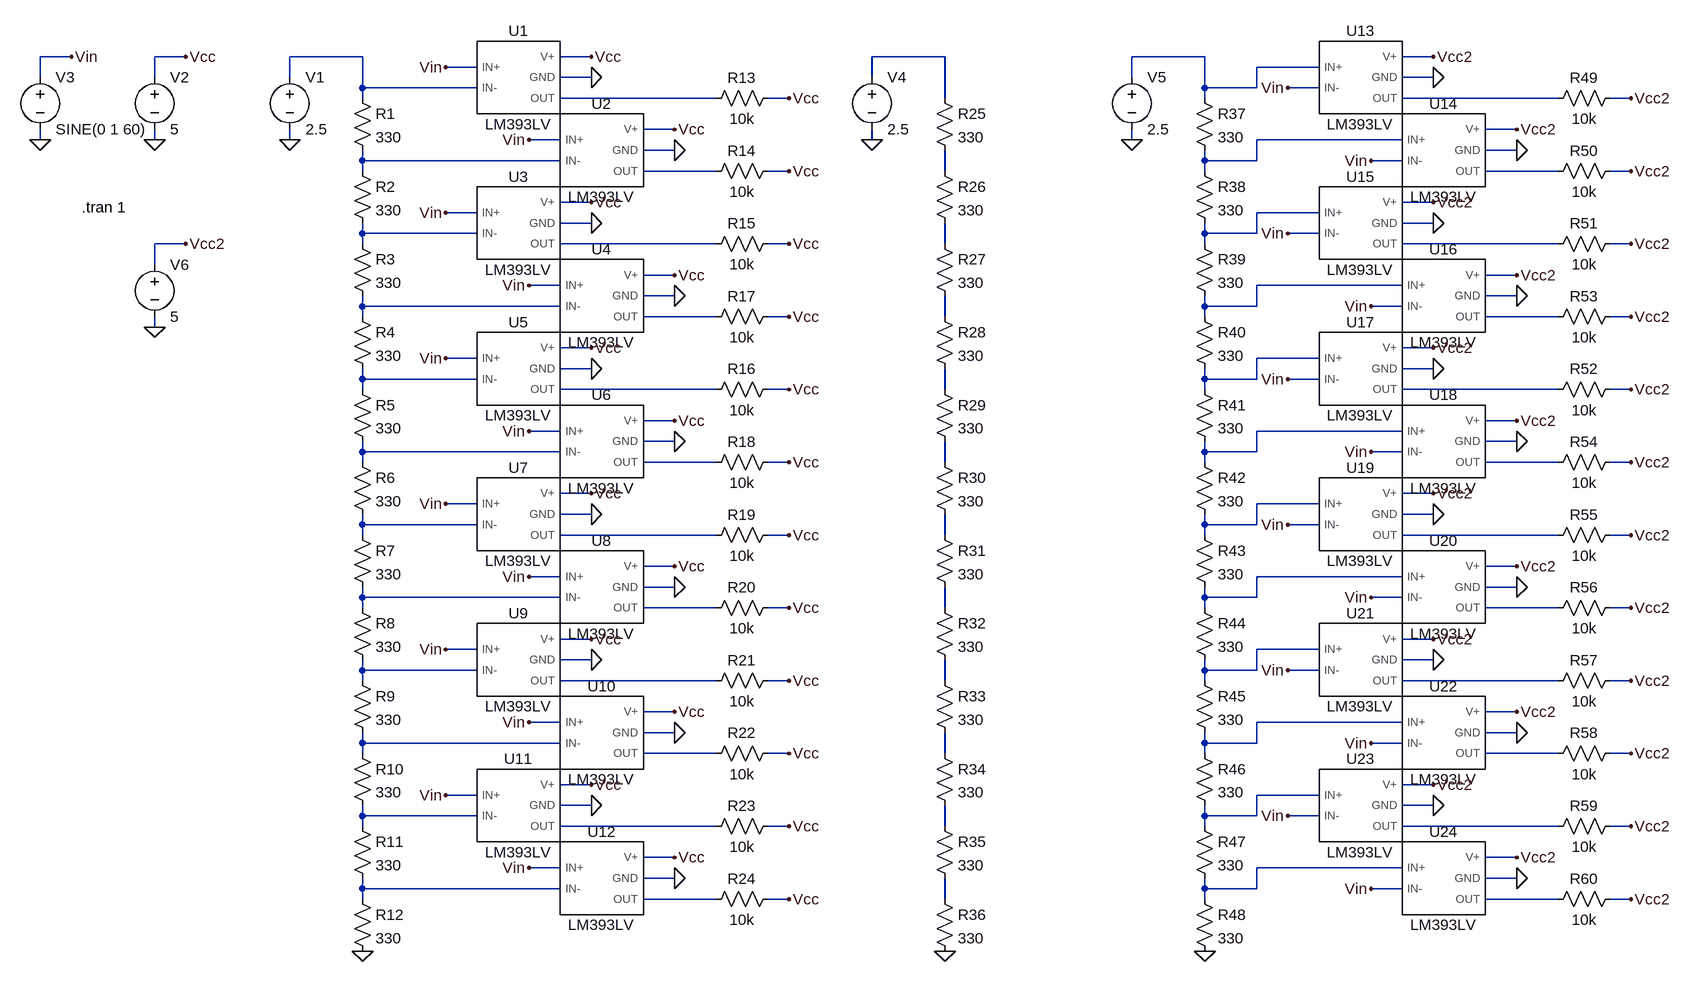
[diagram p0: schematic Voltage Reference Test.asc]
Voltage Reference Test.asc, the LTspice schematic file:
Version 4
SHEET 1 2236 1428
WIRE -272 32 -320 32
WIRE -96 32 -144 32
WIRE 176 32 64 32
WIRE 528 32 480 32
WIRE 1072 32 960 32
WIRE 1472 32 1360 32
WIRE 1824 32 1776 32
WIRE 352 48 304 48
WIRE 1648 48 1552 48
WIRE -320 64 -320 32
WIRE -144 64 -144 32
WIRE 64 64 64 32
WIRE 528 64 480 64
WIRE 960 64 960 32
WIRE 1360 64 1360 32
WIRE 1824 64 1776 64
WIRE 176 80 176 32
WIRE 352 80 176 80
WIRE 1472 80 1472 32
WIRE 1552 80 1552 48
WIRE 1552 80 1472 80
WIRE 1648 80 1600 80
WIRE 176 96 176 80
WIRE 720 96 480 96
WIRE 832 96 800 96
WIRE 1072 96 1072 32
WIRE 1472 96 1472 80
WIRE 2016 96 1776 96
WIRE 2128 96 2096 96
WIRE 656 144 608 144
WIRE 1952 144 1904 144
WIRE -320 160 -320 144
WIRE -144 160 -144 144
WIRE 64 160 64 144
WIRE 480 160 432 160
WIRE 960 160 960 144
WIRE 1360 160 1360 144
WIRE 1776 160 1552 160
WIRE 656 176 608 176
WIRE 1952 176 1904 176
WIRE 176 192 176 176
WIRE 480 192 176 192
WIRE 1472 192 1472 176
WIRE 1552 192 1552 160
WIRE 1552 192 1472 192
WIRE 1776 192 1728 192
WIRE 176 208 176 192
WIRE 720 208 608 208
WIRE 832 208 800 208
WIRE 1072 208 1072 176
WIRE 1472 208 1472 192
WIRE 2016 208 1904 208
WIRE 2128 208 2096 208
WIRE 528 256 480 256
WIRE 1824 256 1776 256
WIRE 352 272 304 272
WIRE 1648 272 1552 272
WIRE 528 288 480 288
WIRE 1824 288 1776 288
WIRE 176 304 176 288
WIRE 352 304 176 304
WIRE 1472 304 1472 288
WIRE 1552 304 1552 272
WIRE 1552 304 1472 304
WIRE 1648 304 1600 304
WIRE -96 320 -144 320
WIRE 176 320 176 304
WIRE 720 320 480 320
WIRE 832 320 800 320
WIRE 1072 320 1072 288
WIRE 1472 320 1472 304
WIRE 2016 320 1776 320
WIRE 2128 320 2096 320
WIRE -144 352 -144 320
WIRE 656 368 608 368
WIRE 1952 368 1904 368
WIRE 480 384 432 384
WIRE 1776 384 1552 384
WIRE 656 400 608 400
WIRE 1952 400 1904 400
WIRE 176 416 176 400
WIRE 480 416 176 416
WIRE 1472 416 1472 400
WIRE 1552 416 1552 384
WIRE 1552 416 1472 416
WIRE 1776 416 1728 416
WIRE 176 432 176 416
WIRE 720 432 608 432
WIRE 832 432 800 432
WIRE 1072 432 1072 400
WIRE 1472 432 1472 416
WIRE 2016 432 1904 432
WIRE 2128 432 2096 432
WIRE -144 448 -144 432
WIRE 528 480 480 480
WIRE 1824 480 1776 480
WIRE 352 496 304 496
WIRE 1648 496 1552 496
WIRE 528 512 480 512
WIRE 1824 512 1776 512
WIRE 176 528 176 512
WIRE 352 528 176 528
WIRE 1472 528 1472 512
WIRE 1552 528 1552 496
WIRE 1552 528 1472 528
WIRE 1648 528 1600 528
WIRE 176 544 176 528
WIRE 720 544 480 544
WIRE 832 544 800 544
WIRE 1072 544 1072 512
WIRE 1472 544 1472 528
WIRE 2016 544 1776 544
WIRE 2128 544 2096 544
WIRE 656 592 608 592
WIRE 1952 592 1904 592
WIRE 480 608 432 608
WIRE 1776 608 1552 608
WIRE 656 624 608 624
WIRE 1952 624 1904 624
WIRE 176 640 176 624
WIRE 480 640 176 640
WIRE 1472 640 1472 624
WIRE 1552 640 1552 608
WIRE 1552 640 1472 640
WIRE 1776 640 1728 640
WIRE 176 656 176 640
WIRE 720 656 608 656
WIRE 832 656 800 656
WIRE 1072 656 1072 624
WIRE 1472 656 1472 640
WIRE 2016 656 1904 656
WIRE 2128 656 2096 656
WIRE 528 704 480 704
WIRE 1824 704 1776 704
WIRE 352 720 304 720
WIRE 1648 720 1552 720
WIRE 528 736 480 736
WIRE 1824 736 1776 736
WIRE 176 752 176 736
WIRE 352 752 176 752
WIRE 1472 752 1472 736
WIRE 1552 752 1552 720
WIRE 1552 752 1472 752
WIRE 1648 752 1600 752
WIRE 176 768 176 752
WIRE 720 768 480 768
WIRE 832 768 800 768
WIRE 1072 768 1072 736
WIRE 1472 768 1472 752
WIRE 2016 768 1776 768
WIRE 2128 768 2096 768
WIRE 656 816 608 816
WIRE 1952 816 1904 816
WIRE 480 832 432 832
WIRE 1776 832 1552 832
WIRE 656 848 608 848
WIRE 1952 848 1904 848
WIRE 176 864 176 848
WIRE 480 864 176 864
WIRE 1472 864 1472 848
WIRE 1552 864 1552 832
WIRE 1552 864 1472 864
WIRE 1776 864 1728 864
WIRE 176 880 176 864
WIRE 720 880 608 880
WIRE 832 880 800 880
WIRE 1072 880 1072 848
WIRE 1472 880 1472 864
WIRE 2016 880 1904 880
WIRE 2128 880 2096 880
WIRE 528 928 480 928
WIRE 1824 928 1776 928
WIRE 352 944 304 944
WIRE 1648 944 1552 944
WIRE 528 960 480 960
WIRE 1824 960 1776 960
WIRE 176 976 176 960
WIRE 352 976 176 976
WIRE 1472 976 1472 960
WIRE 1552 976 1552 944
WIRE 1552 976 1472 976
WIRE 1648 976 1600 976
WIRE 176 992 176 976
WIRE 720 992 480 992
WIRE 832 992 800 992
WIRE 1072 992 1072 960
WIRE 1472 992 1472 976
WIRE 2016 992 1776 992
WIRE 2128 992 2096 992
WIRE 656 1040 608 1040
WIRE 1952 1040 1904 1040
WIRE 480 1056 432 1056
WIRE 1776 1056 1552 1056
WIRE 656 1072 608 1072
WIRE 1952 1072 1904 1072
WIRE 176 1088 176 1072
WIRE 480 1088 176 1088
WIRE 1472 1088 1472 1072
WIRE 1552 1088 1552 1056
WIRE 1552 1088 1472 1088
WIRE 1776 1088 1728 1088
WIRE 176 1104 176 1088
WIRE 720 1104 608 1104
WIRE 832 1104 800 1104
WIRE 1072 1104 1072 1072
WIRE 1472 1104 1472 1088
WIRE 2016 1104 1904 1104
WIRE 2128 1104 2096 1104
WIRE 528 1152 480 1152
WIRE 1824 1152 1776 1152
WIRE 352 1168 304 1168
WIRE 1648 1168 1552 1168
WIRE 528 1184 480 1184
WIRE 1824 1184 1776 1184
WIRE 176 1200 176 1184
WIRE 352 1200 176 1200
WIRE 1472 1200 1472 1184
WIRE 1552 1200 1552 1168
WIRE 1552 1200 1472 1200
WIRE 1648 1200 1600 1200
WIRE 176 1216 176 1200
WIRE 720 1216 480 1216
WIRE 832 1216 800 1216
WIRE 1072 1216 1072 1184
WIRE 1472 1216 1472 1200
WIRE 2016 1216 1776 1216
WIRE 2128 1216 2096 1216
WIRE 656 1264 608 1264
WIRE 1952 1264 1904 1264
WIRE 480 1280 432 1280
WIRE 1776 1280 1552 1280
WIRE 656 1296 608 1296
WIRE 1952 1296 1904 1296
WIRE 176 1312 176 1296
WIRE 480 1312 176 1312
WIRE 1472 1312 1472 1296
WIRE 1552 1312 1552 1280
WIRE 1552 1312 1472 1312
WIRE 1776 1312 1728 1312
WIRE 176 1328 176 1312
WIRE 720 1328 608 1328
WIRE 832 1328 800 1328
WIRE 1072 1328 1072 1296
WIRE 1472 1328 1472 1312
WIRE 2016 1328 1904 1328
WIRE 2128 1328 2096 1328
FLAG 176 1408 0
FLAG 64 160 0
FLAG -96 32 Vcc
FLAG -144 160 0
FLAG 304 48 Vin
FLAG 432 160 Vin
FLAG 304 272 Vin
FLAG 432 384 Vin
FLAG 432 608 Vin
FLAG 432 832 Vin
FLAG 304 496 Vin
FLAG 304 720 Vin
FLAG 304 944 Vin
FLAG 304 1168 Vin
FLAG 432 1056 Vin
FLAG 432 1280 Vin
FLAG -320 160 0
FLAG -272 32 Vin
FLAG 528 32 Vcc
FLAG 528 64 0
FLAG 528 256 Vcc
FLAG 528 288 0
FLAG 656 144 Vcc
FLAG 656 176 0
FLAG 656 368 Vcc
FLAG 656 400 0
FLAG 528 480 Vcc
FLAG 528 512 0
FLAG 528 704 Vcc
FLAG 528 736 0
FLAG 528 928 Vcc
FLAG 528 960 0
FLAG 528 1152 Vcc
FLAG 528 1184 0
FLAG 656 592 Vcc
FLAG 656 624 0
FLAG 656 816 Vcc
FLAG 656 848 0
FLAG 656 1040 Vcc
FLAG 656 1072 0
FLAG 656 1264 Vcc
FLAG 656 1296 0
FLAG 832 96 Vcc
FLAG 832 208 Vcc
FLAG 832 320 Vcc
FLAG 832 544 Vcc
FLAG 832 432 Vcc
FLAG 832 656 Vcc
FLAG 832 768 Vcc
FLAG 832 880 Vcc
FLAG 832 992 Vcc
FLAG 832 1104 Vcc
FLAG 832 1216 Vcc
FLAG 832 1328 Vcc
FLAG 1072 1408 0
FLAG 960 160 0
FLAG 1472 1408 0
FLAG 1360 160 0
FLAG 1600 80 Vin
FLAG 1728 192 Vin
FLAG 1600 304 Vin
FLAG 1728 416 Vin
FLAG 1728 640 Vin
FLAG 1728 864 Vin
FLAG 1600 528 Vin
FLAG 1600 752 Vin
FLAG 1600 976 Vin
FLAG 1600 1200 Vin
FLAG 1728 1088 Vin
FLAG 1728 1312 Vin
FLAG 1824 64 0
FLAG 1824 288 0
FLAG 1952 176 0
FLAG 1952 400 0
FLAG 1824 512 0
FLAG 1824 736 0
FLAG 1824 960 0
FLAG 1824 1184 0
FLAG 1952 624 0
FLAG 1952 848 0
FLAG 1952 1072 0
FLAG 1952 1296 0
FLAG -96 320 Vcc2
FLAG -144 448 0
FLAG 2128 96 Vcc2
FLAG 2128 320 Vcc2
FLAG 2128 208 Vcc2
FLAG 2128 432 Vcc2
FLAG 2128 544 Vcc2
FLAG 2128 656 Vcc2
FLAG 2128 768 Vcc2
FLAG 2128 880 Vcc2
FLAG 2128 992 Vcc2
FLAG 2128 1104 Vcc2
FLAG 2128 1216 Vcc2
FLAG 2128 1328 Vcc2
FLAG 1824 32 Vcc2
FLAG 1824 256 Vcc2
FLAG 1952 144 Vcc2
FLAG 1952 368 Vcc2
FLAG 1952 592 Vcc2
FLAG 1824 480 Vcc2
FLAG 1824 704 Vcc2
FLAG 1952 816 Vcc2
FLAG 1824 928 Vcc2
FLAG 1952 1040 Vcc2
FLAG 1824 1152 Vcc2
FLAG 1952 1264 Vcc2
SYMBOL res 160 80 R0
SYMATTR InstName R1
SYMATTR Value 330
SYMBOL res 160 192 R0
SYMATTR InstName R2
SYMATTR Value 330
SYMBOL res 160 304 R0
SYMATTR InstName R3
SYMATTR Value 330
SYMBOL res 160 416 R0
SYMATTR InstName R4
SYMATTR Value 330
SYMBOL res 160 528 R0
SYMATTR InstName R5
SYMATTR Value 330
SYMBOL res 160 640 R0
SYMATTR InstName R6
SYMATTR Value 330
SYMBOL res 160 752 R0
SYMATTR InstName R7
SYMATTR Value 330
SYMBOL res 160 864 R0
SYMATTR InstName R8
SYMATTR Value 330
SYMBOL res 160 976 R0
SYMATTR InstName R9
SYMATTR Value 330
SYMBOL res 160 1088 R0
SYMATTR InstName R10
SYMATTR Value 330
SYMBOL res 160 1200 R0
SYMATTR InstName R11
SYMATTR Value 330
SYMBOL res 160 1312 R0
SYMATTR InstName R12
SYMATTR Value 330
SYMBOL voltage 64 48 R0
SYMATTR InstName V1
SYMATTR Value 2.5
SYMBOL LM393LV 416 64 R0
SYMATTR InstName U1
SYMBOL LM393LV 544 176 R0
SYMATTR InstName U2
SYMBOL LM393LV 416 288 R0
SYMATTR InstName U3
SYMBOL LM393LV 544 400 R0
SYMATTR InstName U4
SYMBOL LM393LV 416 512 R0
SYMATTR InstName U5
SYMBOL LM393LV 544 624 R0
SYMATTR InstName U6
SYMBOL LM393LV 416 736 R0
SYMATTR InstName U7
SYMBOL LM393LV 544 848 R0
SYMATTR InstName U8
SYMBOL LM393LV 416 960 R0
SYMATTR InstName U9
SYMBOL LM393LV 544 1072 R0
SYMATTR InstName U10
SYMBOL LM393LV 416 1184 R0
SYMATTR InstName U11
SYMBOL LM393LV 544 1296 R0
SYMATTR InstName U12
SYMBOL voltage -144 48 R0
SYMATTR InstName V2
SYMATTR Value 5
SYMBOL voltage -320 48 R0
WINDOW 123 0 0 Left 0
WINDOW 39 0 0 Left 0
SYMATTR InstName V3
SYMATTR Value SINE(0 1 60)
SYMBOL res 816 80 R90
WINDOW 0 0 56 VBottom 2
WINDOW 3 32 56 VTop 2
SYMATTR InstName R13
SYMATTR Value 10k
SYMBOL res 816 192 R90
WINDOW 0 0 56 VBottom 2
WINDOW 3 32 56 VTop 2
SYMATTR InstName R14
SYMATTR Value 10k
SYMBOL res 816 304 R90
WINDOW 0 0 56 VBottom 2
WINDOW 3 32 56 VTop 2
SYMATTR InstName R15
SYMATTR Value 10k
SYMBOL res 816 528 R90
WINDOW 0 0 56 VBottom 2
WINDOW 3 32 56 VTop 2
SYMATTR InstName R16
SYMATTR Value 10k
SYMBOL res 816 416 R90
WINDOW 0 0 56 VBottom 2
WINDOW 3 32 56 VTop 2
SYMATTR InstName R17
SYMATTR Value 10k
SYMBOL res 816 640 R90
WINDOW 0 0 56 VBottom 2
WINDOW 3 32 56 VTop 2
SYMATTR InstName R18
SYMATTR Value 10k
SYMBOL res 816 752 R90
WINDOW 0 0 56 VBottom 2
WINDOW 3 32 56 VTop 2
SYMATTR InstName R19
SYMATTR Value 10k
SYMBOL res 816 864 R90
WINDOW 0 0 56 VBottom 2
WINDOW 3 32 56 VTop 2
SYMATTR InstName R20
SYMATTR Value 10k
SYMBOL res 816 976 R90
WINDOW 0 0 56 VBottom 2
WINDOW 3 32 56 VTop 2
SYMATTR InstName R21
SYMATTR Value 10k
SYMBOL res 816 1088 R90
WINDOW 0 0 56 VBottom 2
WINDOW 3 32 56 VTop 2
SYMATTR InstName R22
SYMATTR Value 10k
SYMBOL res 816 1200 R90
WINDOW 0 0 56 VBottom 2
WINDOW 3 32 56 VTop 2
SYMATTR InstName R23
SYMATTR Value 10k
SYMBOL res 816 1312 R90
WINDOW 0 0 56 VBottom 2
WINDOW 3 32 56 VTop 2
SYMATTR InstName R24
SYMATTR Value 10k
SYMBOL res 1056 80 R0
SYMATTR InstName R25
SYMATTR Value 330
SYMBOL res 1056 192 R0
SYMATTR InstName R26
SYMATTR Value 330
SYMBOL res 1056 304 R0
SYMATTR InstName R27
SYMATTR Value 330
SYMBOL res 1056 416 R0
SYMATTR InstName R28
SYMATTR Value 330
SYMBOL res 1056 528 R0
SYMATTR InstName R29
SYMATTR Value 330
SYMBOL res 1056 640 R0
SYMATTR InstName R30
SYMATTR Value 330
SYMBOL res 1056 752 R0
SYMATTR InstName R31
SYMATTR Value 330
SYMBOL res 1056 864 R0
SYMATTR InstName R32
SYMATTR Value 330
SYMBOL res 1056 976 R0
SYMATTR InstName R33
SYMATTR Value 330
SYMBOL res 1056 1088 R0
SYMATTR InstName R34
SYMATTR Value 330
SYMBOL res 1056 1200 R0
SYMATTR InstName R35
SYMATTR Value 330
SYMBOL res 1056 1312 R0
SYMATTR InstName R36
SYMATTR Value 330
SYMBOL voltage 960 48 R0
SYMATTR InstName V4
SYMATTR Value 2.5
SYMBOL res 1456 80 R0
SYMATTR InstName R37
SYMATTR Value 330
SYMBOL res 1456 192 R0
SYMATTR InstName R38
SYMATTR Value 330
SYMBOL res 1456 304 R0
SYMATTR InstName R39
SYMATTR Value 330
SYMBOL res 1456 416 R0
SYMATTR InstName R40
SYMATTR Value 330
SYMBOL res 1456 528 R0
SYMATTR InstName R41
SYMATTR Value 330
SYMBOL res 1456 640 R0
SYMATTR InstName R42
SYMATTR Value 330
SYMBOL res 1456 752 R0
SYMATTR InstName R43
SYMATTR Value 330
SYMBOL res 1456 864 R0
SYMATTR InstName R44
SYMATTR Value 330
SYMBOL res 1456 976 R0
SYMATTR InstName R45
SYMATTR Value 330
SYMBOL res 1456 1088 R0
SYMATTR InstName R46
SYMATTR Value 330
SYMBOL res 1456 1200 R0
SYMATTR InstName R47
SYMATTR Value 330
SYMBOL res 1456 1312 R0
SYMATTR InstName R48
SYMATTR Value 330
SYMBOL voltage 1360 48 R0
SYMATTR InstName V5
SYMATTR Value 2.5
SYMBOL LM393LV 1712 64 R0
SYMATTR InstName U13
SYMBOL LM393LV 1840 176 R0
SYMATTR InstName U14
SYMBOL LM393LV 1712 288 R0
SYMATTR InstName U15
SYMBOL LM393LV 1840 400 R0
SYMATTR InstName U16
SYMBOL LM393LV 1712 512 R0
SYMATTR InstName U17
SYMBOL LM393LV 1840 624 R0
SYMATTR InstName U18
SYMBOL LM393LV 1712 736 R0
SYMATTR InstName U19
SYMBOL LM393LV 1840 848 R0
SYMATTR InstName U20
SYMBOL LM393LV 1712 960 R0
SYMATTR InstName U21
SYMBOL LM393LV 1840 1072 R0
SYMATTR InstName U22
SYMBOL LM393LV 1712 1184 R0
SYMATTR InstName U23
SYMBOL LM393LV 1840 1296 R0
SYMATTR InstName U24
SYMBOL res 2112 80 R90
WINDOW 0 0 56 VBottom 2
WINDOW 3 32 56 VTop 2
SYMATTR InstName R49
SYMATTR Value 10k
SYMBOL res 2112 192 R90
WINDOW 0 0 56 VBottom 2
WINDOW 3 32 56 VTop 2
SYMATTR InstName R50
SYMATTR Value 10k
SYMBOL res 2112 304 R90
WINDOW 0 0 56 VBottom 2
WINDOW 3 32 56 VTop 2
SYMATTR InstName R51
SYMATTR Value 10k
SYMBOL res 2112 528 R90
WINDOW 0 0 56 VBottom 2
WINDOW 3 32 56 VTop 2
SYMATTR InstName R52
SYMATTR Value 10k
SYMBOL res 2112 416 R90
WINDOW 0 0 56 VBottom 2
WINDOW 3 32 56 VTop 2
SYMATTR InstName R53
SYMATTR Value 10k
SYMBOL res 2112 640 R90
WINDOW 0 0 56 VBottom 2
WINDOW 3 32 56 VTop 2
SYMATTR InstName R54
SYMATTR Value 10k
SYMBOL res 2112 752 R90
WINDOW 0 0 56 VBottom 2
WINDOW 3 32 56 VTop 2
SYMATTR InstName R55
SYMATTR Value 10k
SYMBOL res 2112 864 R90
WINDOW 0 0 56 VBottom 2
WINDOW 3 32 56 VTop 2
SYMATTR InstName R56
SYMATTR Value 10k
SYMBOL res 2112 976 R90
WINDOW 0 0 56 VBottom 2
WINDOW 3 32 56 VTop 2
SYMATTR InstName R57
SYMATTR Value 10k
SYMBOL res 2112 1088 R90
WINDOW 0 0 56 VBottom 2
WINDOW 3 32 56 VTop 2
SYMATTR InstName R58
SYMATTR Value 10k
SYMBOL res 2112 1200 R90
WINDOW 0 0 56 VBottom 2
WINDOW 3 32 56 VTop 2
SYMATTR InstName R59
SYMATTR Value 10k
SYMBOL res 2112 1312 R90
WINDOW 0 0 56 VBottom 2
WINDOW 3 32 56 VTop 2
SYMATTR InstName R60
SYMATTR Value 10k
SYMBOL voltage -144 336 R0
SYMATTR InstName V6
SYMATTR Value 5
TEXT -256 264 Left 2 !.tran 1

The netlist it stands for:
* Voltage Reference Test.asc
R1 N001 N007 330
R2 N007 N012 330
R3 N012 N017 330
R4 N017 N022 330
R5 N022 N027 330
R6 N027 N032 330
R7 N032 N037 330
R8 N037 N042 330
R9 N042 N047 330
R10 N047 N052 330
R11 N052 N057 330
R12 N057 0 330
V1 N001 0 2.5
XU1 Vin N001 Vcc 0 N004 LM393LV  ; pins IN+ IN- V+ GND OUT
XU2 Vin N007 Vcc 0 N008 LM393LV  ; pins IN+ IN- V+ GND OUT
XU3 Vin N012 Vcc 0 N013 LM393LV  ; pins IN+ IN- V+ GND OUT
XU4 Vin N017 Vcc 0 N018 LM393LV  ; pins IN+ IN- V+ GND OUT
XU5 Vin N022 Vcc 0 N023 LM393LV  ; pins IN+ IN- V+ GND OUT
XU6 Vin N027 Vcc 0 N028 LM393LV  ; pins IN+ IN- V+ GND OUT
XU7 Vin N032 Vcc 0 N033 LM393LV  ; pins IN+ IN- V+ GND OUT
XU8 Vin N037 Vcc 0 N038 LM393LV  ; pins IN+ IN- V+ GND OUT
XU9 Vin N042 Vcc 0 N043 LM393LV  ; pins IN+ IN- V+ GND OUT
XU10 Vin N047 Vcc 0 N048 LM393LV  ; pins IN+ IN- V+ GND OUT
XU11 Vin N052 Vcc 0 N053 LM393LV  ; pins IN+ IN- V+ GND OUT
XU12 Vin N057 Vcc 0 N058 LM393LV  ; pins IN+ IN- V+ GND OUT
V2 Vcc 0 5
V3 Vin 0 SINE(0 1 60)
R13 Vcc N004 10k
R14 Vcc N008 10k
R15 Vcc N013 10k
R16 Vcc N023 10k
R17 Vcc N018 10k
R18 Vcc N028 10k
R19 Vcc N033 10k
R20 Vcc N038 10k
R21 Vcc N043 10k
R22 Vcc N048 10k
R23 Vcc N053 10k
R24 Vcc N058 10k
R25 N002 N009 330
R26 N009 N014 330
R27 N014 N019 330
R28 N019 N024 330
R29 N024 N029 330
R30 N029 N034 330
R31 N034 N039 330
R32 N039 N044 330
R33 N044 N049 330
R34 N049 N054 330
R35 N054 N059 330
R36 N059 0 330
V4 N002 0 2.5
R37 N003 N006 330
R38 N006 N011 330
R39 N011 N016 330
R40 N016 N021 330
R41 N021 N026 330
R42 N026 N031 330
R43 N031 N036 330
R44 N036 N041 330
R45 N041 N046 330
R46 N046 N051 330
R47 N051 N056 330
R48 N056 0 330
V5 N003 0 2.5
XU13 N003 Vin Vcc2 0 N005 LM393LV  ; pins IN+ IN- V+ GND OUT
XU14 N006 Vin Vcc2 0 N010 LM393LV  ; pins IN+ IN- V+ GND OUT
XU15 N011 Vin Vcc2 0 N015 LM393LV  ; pins IN+ IN- V+ GND OUT
XU16 N016 Vin Vcc2 0 N020 LM393LV  ; pins IN+ IN- V+ GND OUT
XU17 N021 Vin Vcc2 0 N025 LM393LV  ; pins IN+ IN- V+ GND OUT
XU18 N026 Vin Vcc2 0 N030 LM393LV  ; pins IN+ IN- V+ GND OUT
XU19 N031 Vin Vcc2 0 N035 LM393LV  ; pins IN+ IN- V+ GND OUT
XU20 N036 Vin Vcc2 0 N040 LM393LV  ; pins IN+ IN- V+ GND OUT
XU21 N041 Vin Vcc2 0 N045 LM393LV  ; pins IN+ IN- V+ GND OUT
XU22 N046 Vin Vcc2 0 N050 LM393LV  ; pins IN+ IN- V+ GND OUT
XU23 N051 Vin Vcc2 0 N055 LM393LV  ; pins IN+ IN- V+ GND OUT
XU24 N056 Vin Vcc2 0 N060 LM393LV  ; pins IN+ IN- V+ GND OUT
R49 Vcc2 N005 10k
R50 Vcc2 N010 10k
R51 Vcc2 N015 10k
R52 Vcc2 N025 10k
R53 Vcc2 N020 10k
R54 Vcc2 N030 10k
R55 Vcc2 N035 10k
R56 Vcc2 N040 10k
R57 Vcc2 N045 10k
R58 Vcc2 N050 10k
R59 Vcc2 N055 10k
R60 Vcc2 N060 10k
V6 Vcc2 0 5
.tran 1
.lib C:\Users\alfaw\Documents\LTspice\Spectrum Analyzer\snom697a\lm393lv.lib
.backanno
.end